# Altium schematic sheet DBoard_Conn.SchDoc: {Наименование}
size 420 x 297 mm; DocumentNumber: НРДЦ.ХХХХХХ.ХХХ ХХ; SheetNumber: {}; SheetTotal: {}; PageSetup: Record=PageOptions|CenterHorizontal=False|CenterVertical=False|PrintScale=0.95|XCorrection=0.00|YCorrection=0.00|PrintKind=1|BorderSize=5000000|LeftOffset=0|BottomOffset=0|Orientation=1|PaperLength=1000|PaperWidth=1000|Scale=100|PaperSource=15|PrintQuality=600|MediaType=1|DitherType=10|PaperKind=A4|PrintScaleMode=1; Rule: PcbType=ProtelPcb
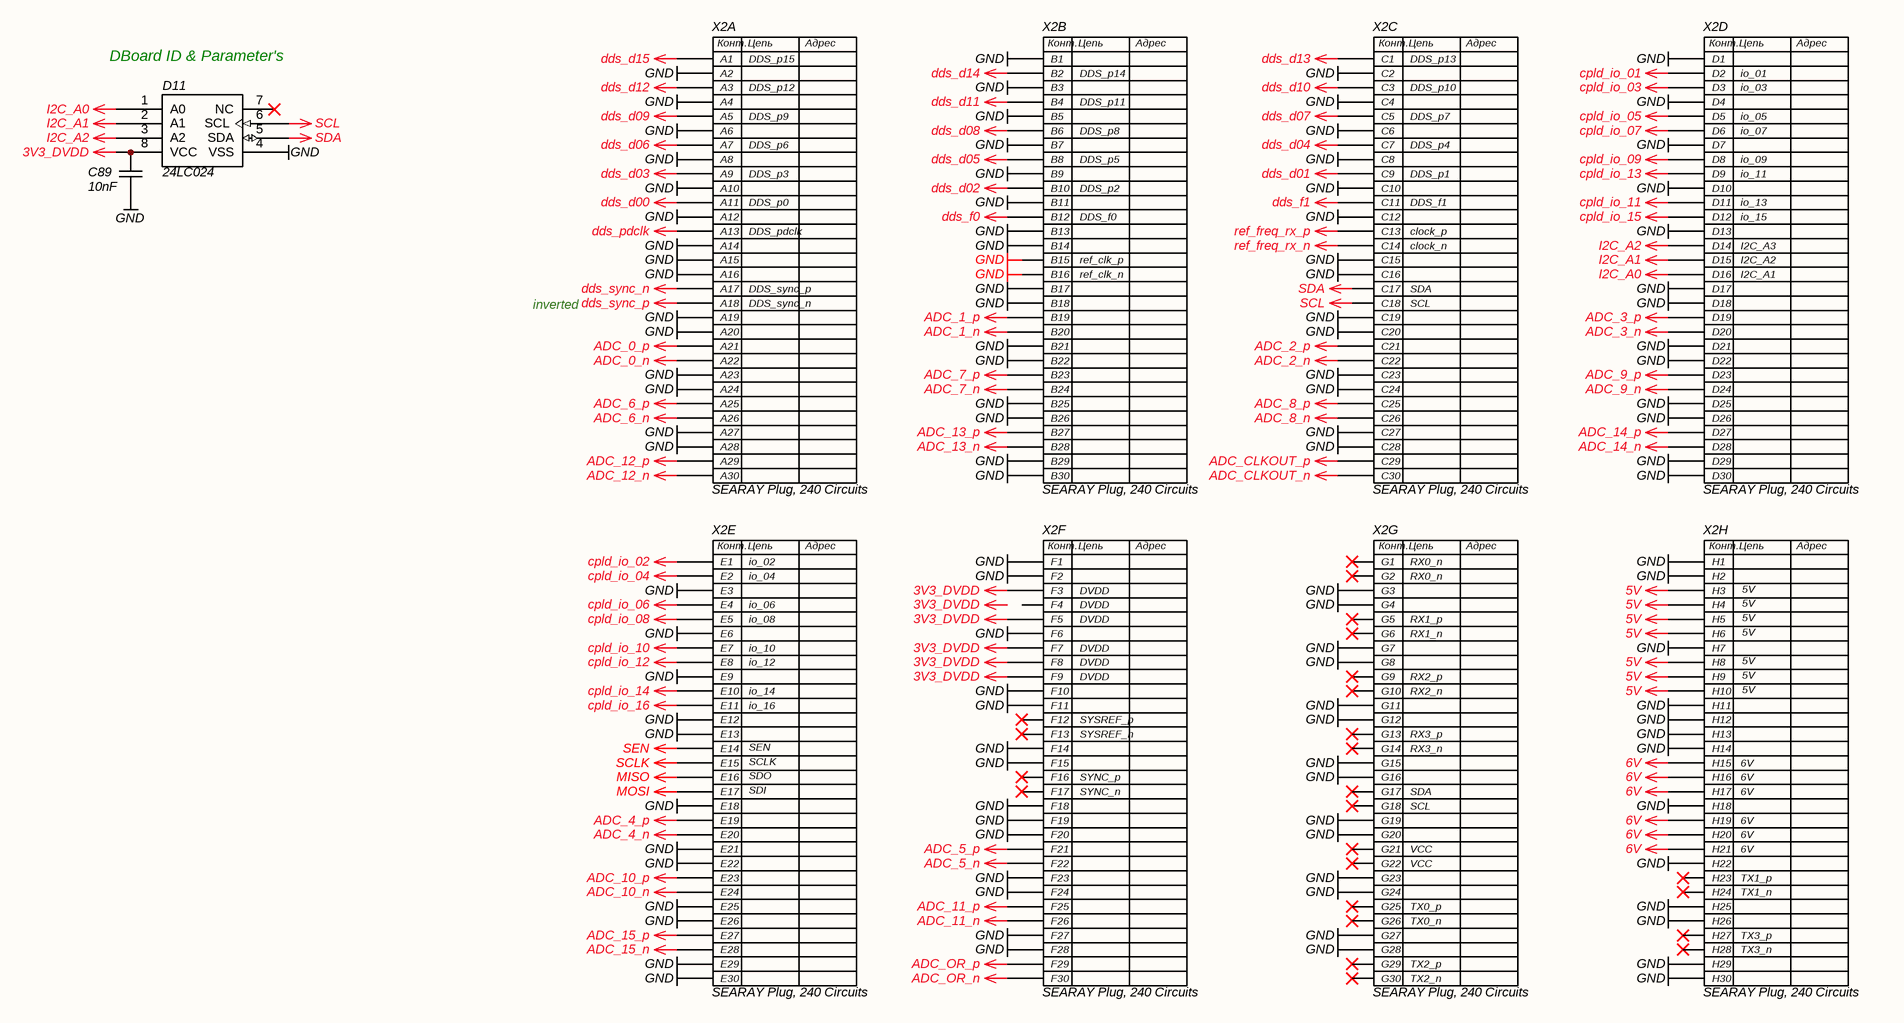
[diagram p0: DBoard_Conn.SchDoc]

## Parts
C89  value 10nF  [C0402]  (hidden comment: CAP)
D11  24LC024  [SOIC_SN8]
X2  SEARAY Plug, 240 Circuits  [Molex_459703185]  (parts A,B,C,D,E,F,G,H of 8)

## Nets
3V3_DVDD: C89.2 D11.8(VCC) X2.F3 X2.F5 X2.F7 X2.F8 X2.F9
5V: X2.H3 X2.H4 X2.H5 X2.H6 X2.H8 X2.H9 X2.H10
6V: X2.H15 X2.H16 X2.H17 X2.H19 X2.H20 X2.H21
ADC_0_n: X2.A22
ADC_0_p: X2.A21
ADC_1_n: X2.B20
ADC_1_p: X2.B19
ADC_2_n: X2.C22
ADC_2_p: X2.C21
ADC_3_n: X2.D20
ADC_3_p: X2.D19
ADC_4_n: X2.E20
ADC_4_p: X2.E19
ADC_5_n: X2.F22
ADC_5_p: X2.F21
ADC_6_n: X2.A26
ADC_6_p: X2.A25
ADC_7_n: X2.B24
ADC_7_p: X2.B23
ADC_8_n: X2.C26
ADC_8_p: X2.C25
ADC_9_n: X2.D24
ADC_9_p: X2.D23
ADC_10_n: X2.E24
ADC_10_p: X2.E23
ADC_11_n: X2.F26
ADC_11_p: X2.F25
ADC_12_n: X2.A30
ADC_12_p: X2.A29
ADC_13_n: X2.B28
ADC_13_p: X2.B27
ADC_14_n: X2.D28
ADC_14_p: X2.D27
ADC_15_n: X2.E28
ADC_15_p: X2.E27
ADC_CLKOUT_n: X2.C30
ADC_CLKOUT_p: X2.C29
ADC_OR_n: X2.F30
ADC_OR_p: X2.F29
cpld_io_01: X2.D2
cpld_io_02: X2.E1
cpld_io_03: X2.D3
cpld_io_04: X2.E2
cpld_io_05: X2.D5
cpld_io_06: X2.E4
cpld_io_07: X2.D6
cpld_io_08: X2.E5
cpld_io_09: X2.D8
cpld_io_10: X2.E7
cpld_io_11: X2.D11
cpld_io_12: X2.E8
cpld_io_13: X2.D9
cpld_io_14: X2.E10
cpld_io_15: X2.D12
cpld_io_16: X2.E11
dds_d00: X2.A11
dds_d01: X2.C9
dds_d02: X2.B10
dds_d03: X2.A9
dds_d04: X2.C7
dds_d05: X2.B8
dds_d06: X2.A7
dds_d07: X2.C5
dds_d08: X2.B6
dds_d09: X2.A5
dds_d10: X2.C3
dds_d11: X2.B4
dds_d12: X2.A3
dds_d13: X2.C1
dds_d14: X2.B2
dds_d15: X2.A1
dds_f0: X2.B12
dds_f1: X2.C11
dds_pdclk: X2.A13
dds_sync_n: X2.A17
dds_sync_p: X2.A18
GND: C89.1 D11.4(VSS) X2.A2 X2.A4 X2.A6 X2.A8 X2.A10 X2.A12 X2.A14 X2.A15 X2.A16 X2.A19 X2.A20 X2.A23 X2.A24 X2.A27 X2.A28 X2.B1 X2.B3 X2.B5 X2.B7 X2.B9 X2.B11 X2.B13 X2.B14 X2.B15 X2.B16 X2.B17 X2.B18 X2.B21 X2.B22 X2.B25 X2.B26 X2.B29 X2.B30 X2.C2 X2.C4 X2.C6 X2.C8 X2.C10 X2.C12 X2.C15 X2.C16 X2.C19 X2.C20 X2.C23 X2.C24 X2.C27 X2.C28 X2.D1 X2.D4 X2.D7 X2.D10 X2.D13 X2.D17 X2.D18 X2.D21 X2.D22 X2.D25 X2.D26 X2.D29 X2.D30 X2.E3 X2.E6 X2.E9 X2.E12 X2.E13 X2.E18 X2.E21 X2.E22 X2.E25 X2.E26 X2.E29 X2.E30 X2.F1 X2.F2 X2.F6 X2.F10 X2.F11 X2.F14 X2.F15 X2.F18 X2.F19 X2.F20 X2.F23 X2.F24 X2.F27 X2.F28 X2.G3 X2.G4 X2.G7 X2.G8 X2.G11 X2.G12 X2.G15 X2.G16 X2.G19 X2.G20 X2.G23 X2.G24 X2.G27 X2.G28 X2.H1 X2.H2 X2.H7 X2.H11 X2.H12 X2.H13 X2.H14 X2.H18 X2.H22 X2.H25 X2.H26 X2.H29 X2.H30
I2C_A0: D11.1(A0) X2.D16
I2C_A1: D11.2(A1) X2.D15
I2C_A2: D11.3(A2) X2.D14
MISO: X2.E16
MOSI: X2.E17
ref_freq_rx_n: X2.C14
ref_freq_rx_p: X2.C13
SCL: D11.6(SCL) X2.C18
SCLK: X2.E15
SDA: D11.5(SDA) X2.C17
SEN: X2.E14

Not connected (* = marked no-connect by the designer): D11 7(NC)*; X2 F4 F12* F13* F16* F17* G1* G2* G5* G6* G9* G10* G13* G14* G17* G18* G21* G22* G25* G26* G29* G30* H23* H24* H27* H28*

## Notes on the sheet
- (near D11) DBoard ID & Parameter's
- (near X2) io_01
- (near X2) io_03
- (near X2) io_05
- (near X2) io_07
- (near X2) io_09
- (near X2) io_11
- (near X2) io_13
- (near X2) ref_clk_p
- (near X2) ref_clk_n
- (near X2) clock_n
- (near X2) clock_p
- (near X2) I2C_A2
- (near X2) I2C_A1
- (near X2) I2C_A3
- (near X2) io_15
- inverted
- (near X2) SCL
- (near X2) SDA
- (near X2) io_02
- (near X2) io_04
- (near X2) io_06
- (near X2) io_08
- (near X2) DVDD
- (near X2) 5V
- (near X2) io_10
- (near X2) io_12
- (near X2) io_14
- (near X2) io_16
- (near X2) SCLK
- (near X2) SDO
- (near X2) SEN
- (near X2) 6V
- (near X2) SDI
- Labels drawn without touching a wire or pin: 3V3_DVDD, DDS_f0, DDS_f1, DDS_p0, DDS_p1, DDS_p2, DDS_p3, DDS_p4, DDS_p5, DDS_p6, DDS_p7, DDS_p8, DDS_p9, DDS_p10, DDS_p11, DDS_p12, DDS_p13, DDS_p14, DDS_p15, DDS_pdclk, DDS_sync_n, DDS_sync_p, RX0_n, RX1_n, RX1_p, RX2_n, RX2_p, RX3_n, RX3_p, SCL, SDA, SYNC_n, SYNC_p, SYSREF_n, SYSREF_p, TX0_n, TX0_p, TX1_n, TX1_p, TX2_n, TX2_p, TX3_n, TX3_p, VCC
- Подп. и дата
- Инв. № дубл.
- Взам. инв. №
- Инв. № подл.
- Лист
- Изм.
- № докум.
- Подп.
- Дата
- Копировал
- Формат А3
- (in symbol Molex_SEARAY™ 45970, part A) Конт.; Цепь; Адрес
- (in symbol Molex_SEARAY™ 45970, part B) Конт.; Цепь; Адрес
- (in symbol Molex_SEARAY™ 45970, part C) Конт.; Цепь; Адрес
- (in symbol Molex_SEARAY™ 45970, part D) Конт.; Цепь; Адрес
- (in symbol Molex_SEARAY™ 45970, part E) Конт.; Цепь; Адрес
- (in symbol Molex_SEARAY™ 45970, part F) Конт.; Цепь; Адрес
- (in symbol Molex_SEARAY™ 45970, part G) Конт.; Цепь; Адрес
- (in symbol Molex_SEARAY™ 45970, part H) Конт.; Цепь; Адрес

## Library data of the parts
C89 = CAP: SMD Capacitor; Manufacturer: Murata; Material: X7R; Tolerance: 10%; Voltage: 25V; Type: Ceramic Capacitor; P/N: GRM155R71E103KA01D
D11 = 24LC024: I2C EEPROM; Manufacturer: Microchip; Capacity: 2kbit; Max Clock: 400 kHz; Voltage: 2.5-5.5V; Name: 24LC024; Package: SOIC-8; Type: I2C EEPROM
X2 = Molex_SEARAY™ 45970: 1.27mm Pitch, SEARAY Plug, 240 Circuits, 2.00mm Unmated Height, 8 Rows, with Pegs; Manufacturer: Molex; Name: 459703185; Pitch: 0.050" (1.27mm); Number of Positions: 240; P/N: 45970-3185; Mates With: SEARAY™ 45971 Series; IsBGA: TRUE; Mates With P/N: 45971-3185; Series: SEARAY™ 45970; Number of Rows: 8; Mounting Type: Surface Mount